# Altium schematic sheet Schematic.SchDoc: YPT
size A; DrawnBy: Anusha Kundargi; Engineer: Anusha Kundargi; DocumentNumber: v1.0; Revision: v1.0; SheetNumber: 1; SheetTotal: 1
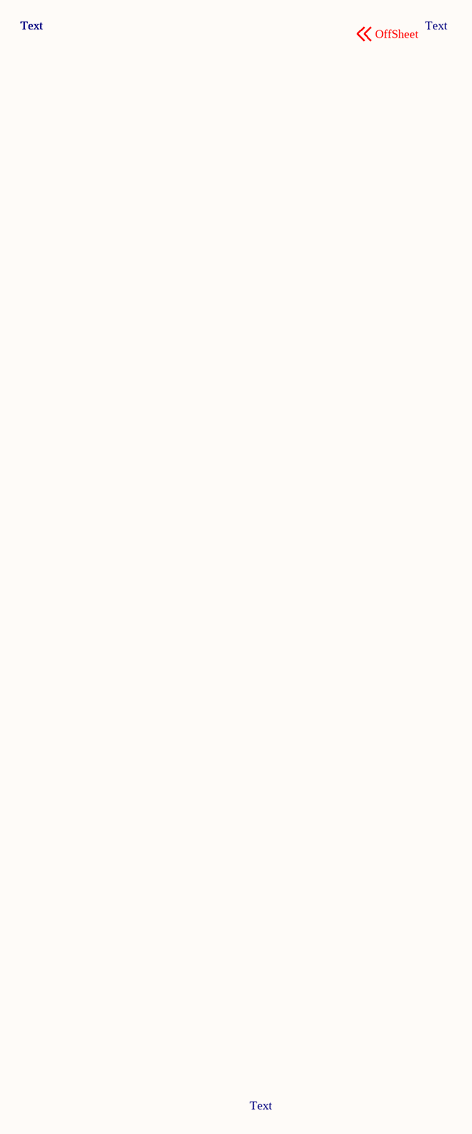
[diagram p0: Schematic.SchDoc]

## Notes on the sheet
- Text
- Labels drawn without touching a wire or pin: OffSheet